# EAGLE schematic montaj_senzor (EAGLE 9.6.2)
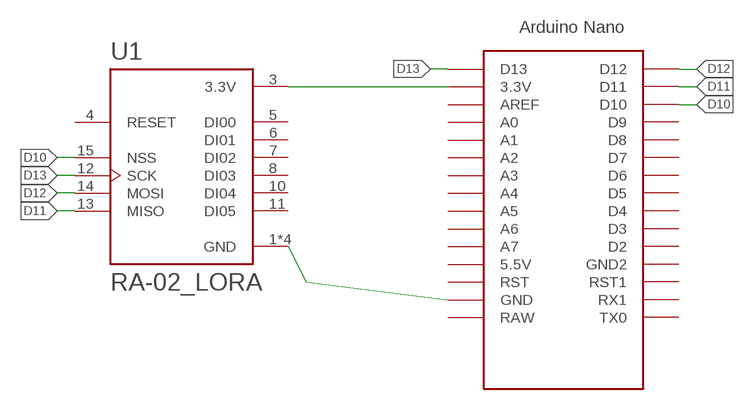
[diagram p0: schematic, sheet 1]

## Parts
U1  RA-02_LORA  [MODULE_RA-02_LORA]
U$1  NANO  [NANO]

## Nets
D10: U1.15(NSS) U$1.D10
D11: U1.13(MISO) U$1.D11
D12: U1.14(MOSI) U$1.D12
D13: U1.12(SCK) U$1.D13
N$1: U1.3(3.3V) U$1.3.3V
N$2: U1.1(GND) U1.2(GND) U1.9(GND) U1.16(GND) U$1.GND
Unconnected: U1.4(RESET) U1.5(DI00) U1.6(DI01) U1.7(DI02) U1.8(DI03) U1.10(DI04) U1.11(DI05) U$1.5V(5.5V) U$1.A0 U$1.A1 U$1.A2 U$1.A3 U$1.A4 U$1.A5 U$1.A6 U$1.A7 U$1.AREF U$1.D2 U$1.D3 U$1.D4 U$1.D5 U$1.D6 U$1.D7 U$1.D8 U$1.D9 U$1.GND1(GND2) U$1.ICSP1 U$1.ICSP2 U$1.ICSP3 U$1.ICSP4 U$1.ICSP5 U$1.ICSP6 U$1.RAW U$1.RST U$1.RST1 U$1.RX1 U$1.TX0

## Library data of the parts
U1 = RA-02_LORA:RA-02_LORA: Ra-02 LoRa RF M5Stack Platform Evaluation Expansion Board Check availability <https://pricing.snapeda.com/parts/Ra-02%20LoRa/AI-Thinker/view-part?ref=eda>; AVAILABILITY: Not in stock; CHECK_PRICES: https://www.snapeda.com/parts/Ra-02%20LoRa/AI-Thinker/view-part/?ref=eda; DESCRIPTION: Ra-02 LoRa RF M5Stack Platform Evaluation Expansion Board; MF: AI-Thinker; MP: Ra-02 LoRa; PACKAGE: None; PRICE: None; SNAPEDA_LINK: https://www.snapeda.com/parts/Ra-02%20LoRa/AI-Thinker/view-part/?ref=snap
U$1 = Arduino-clone:NANO: Arduino Nano